# Altium schematic sheet Sheet1.SchDoc
size A3
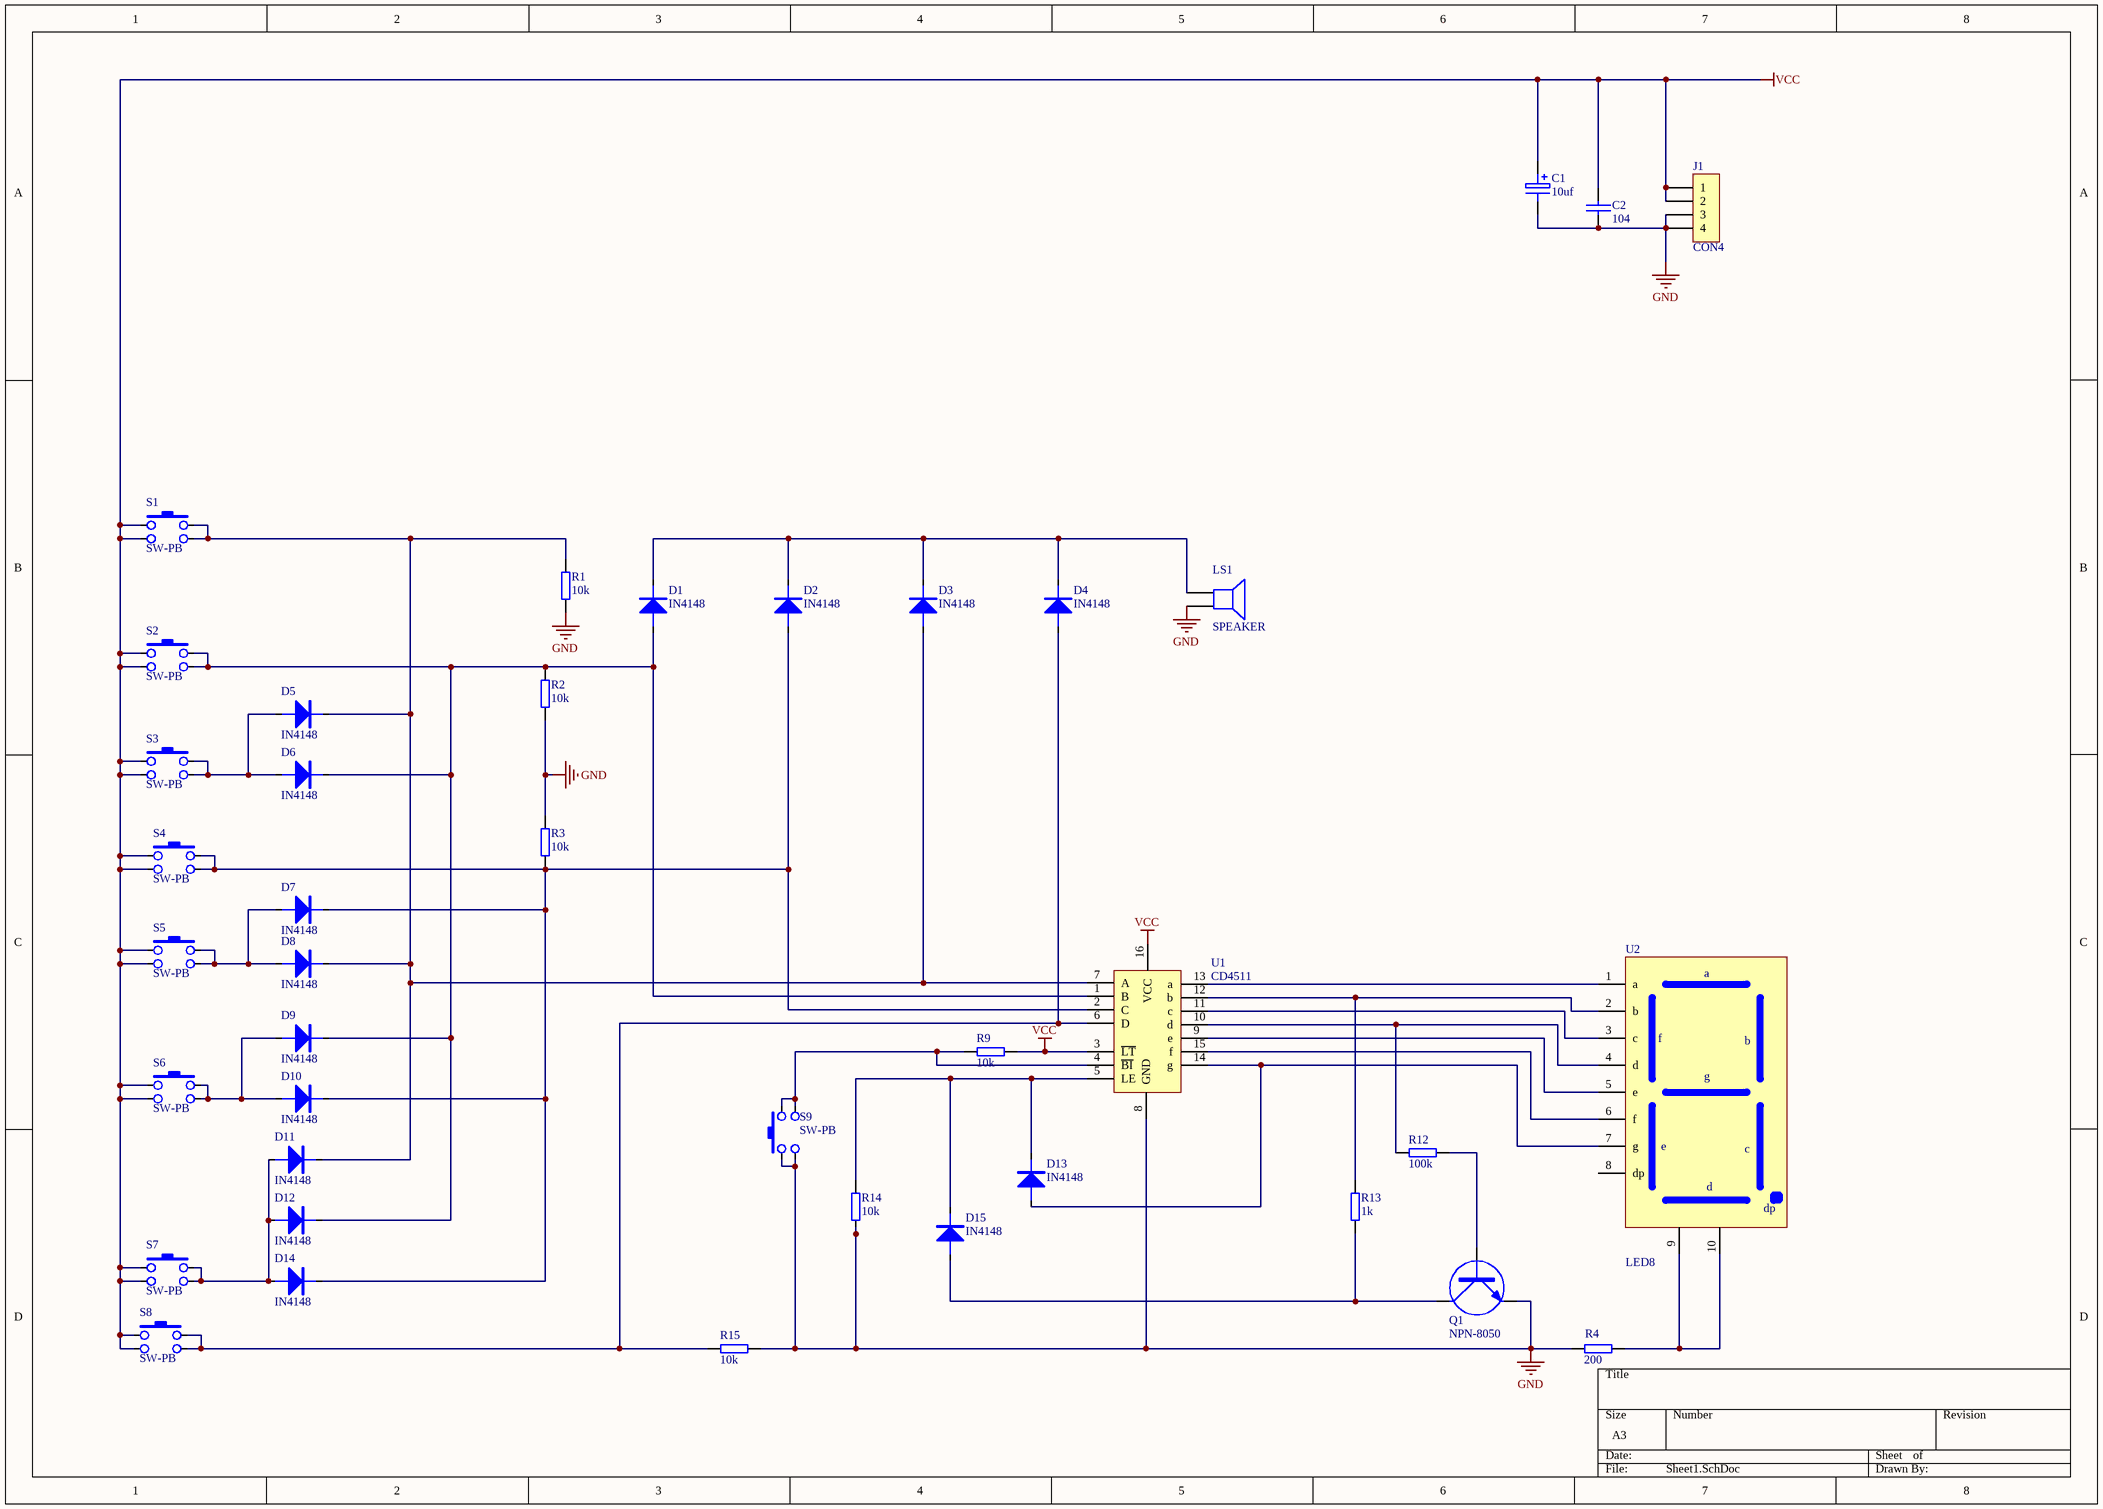
[diagram p0: Sheet1.SchDoc]

## Parts
C1  10uf  [RB.1/.2]
C2  104  [RAD0.1]
D1  IN4148  [DIODE0.3]
D2  IN4148  [DIODE0.3]
D3  IN4148  [DIODE0.3]
D4  IN4148  [DIODE0.3]
D5  IN4148  [DIODE0.3]
D6  IN4148  [DIODE0.3]
D7  IN4148  [DIODE0.3]
D8  IN4148  [DIODE0.3]
D9  IN4148  [DIODE0.3]
D10  IN4148  [DIODE0.3]
D11  IN4148  [DIODE0.3]
D12  IN4148  [DIODE0.3]
D13  IN4148  [DIODE0.3]
D14  IN4148  [DIODE0.3]
D15  IN4148  [DIODE0.3]
J1  CON4  [SIP4]
LS1  SPEAKER  [H]
Q1  NPN-8050  [TO-92C]
R1  10k  [AXIAL0.3]
R2  10k  [AXIAL0.3]
R3  10k  [AXIAL0.3]
R4  200  [AXIAL0.3]
R9  10k  [AXIAL0.3]
R12  100k  [AXIAL0.3]
R13  1k  [AXIAL0.3]
R14  10k  [AXIAL0.3]
R15  10k  [AXIAL0.3]
S1  SW-PB  [SWPB]
S2  SW-PB  [SWPB]
S3  SW-PB  [SWPB]
S4  SW-PB  [SWPB]
S5  SW-PB  [SWPB]
S6  SW-PB  [SWPB]
S7  SW-PB  [SWPB]
S8  SW-PB  [SWPB]
S9  SW-PB  [SWPB]
U1  CD4511  [DIP16]
U2  LED8  [LED8]

## Nets
GND: C1.2 C2.2 J1.3 J1.4 LS1.2 Q1.E R1.1 R2.1 R3.2 R4.1 R14.1 R15.2 S9.1 S9.3 U1.8(GND)
VCC: C1.1 C2.1 J1.1 J1.2 R9.2 S1.1 S1.3 S2.1 S2.3 S3.1 S3.3 S4.1 S4.3 S5.1 S5.3 S6.1 S6.3 S7.1 S7.3 S8.1 S8.3 U1.3(~{LT}) U1.16(VCC)
NetD1_A: D1.A D6.K D9.K D12.K R2.2 S2.2 S2.4 U1.1(B)
NetD1_K: D1.K D2.K D3.K D4.K LS1.1
NetD2_A: D2.A D7.K D10.K D14.K R3.1 S4.2 S4.4 U1.2(C)
NetD3_A: D3.A D5.K D8.K D11.K R1.2 S1.2 S1.4 U1.7(A)
NetD4_A: D4.A R15.1 S8.2 S8.4 U1.6(D)
NetD5_A: D5.A D6.A S3.2 S3.4
NetD7_A: D7.A D8.A S5.2 S5.4
NetD9_A: D9.A D10.A S6.2 S6.4
NetD11_A: D11.A D12.A D14.A S7.2 S7.4
NetD13_A: D13.A U1.14(g) U2.7(g)
NetD13_K: D13.K D15.K R14.2 U1.5(LE)
NetD15_A: D15.A Q1.C R13.1
NetQ1_B: Q1.B R12.2
NetR4_2: R4.2 U2.9(COM) U2.10(COM)
NetR9_1: R9.1 S9.2 S9.4 U1.4(~{BI})
NetR12_1: R12.1 U1.10(d) U2.4(d)
NetR13_2: R13.2 U1.12(b) U2.2(b)
NetU1_9: U1.9(e) U2.5(e)
NetU1_11: U1.11(c) U2.3(c)
NetU1_13: U1.13(a) U2.1(a)
NetU1_15: U1.15(f) U2.6(f)

Not connected (* = marked no-connect by the designer): U2 8(dp)

## Library data of the parts
C1 = ELECTRO1: Electrolytic Capacitor
C2 = CAP: Capacitor
D1-D15 = DIODE
J1 = CON4: Connector
Q1 = NPN
R1-R4 R9 R12-R15 = RES2